# EasyEDA Pro project 立创EDAPRO__v1.1.0.eprj

# Board A4标准轴
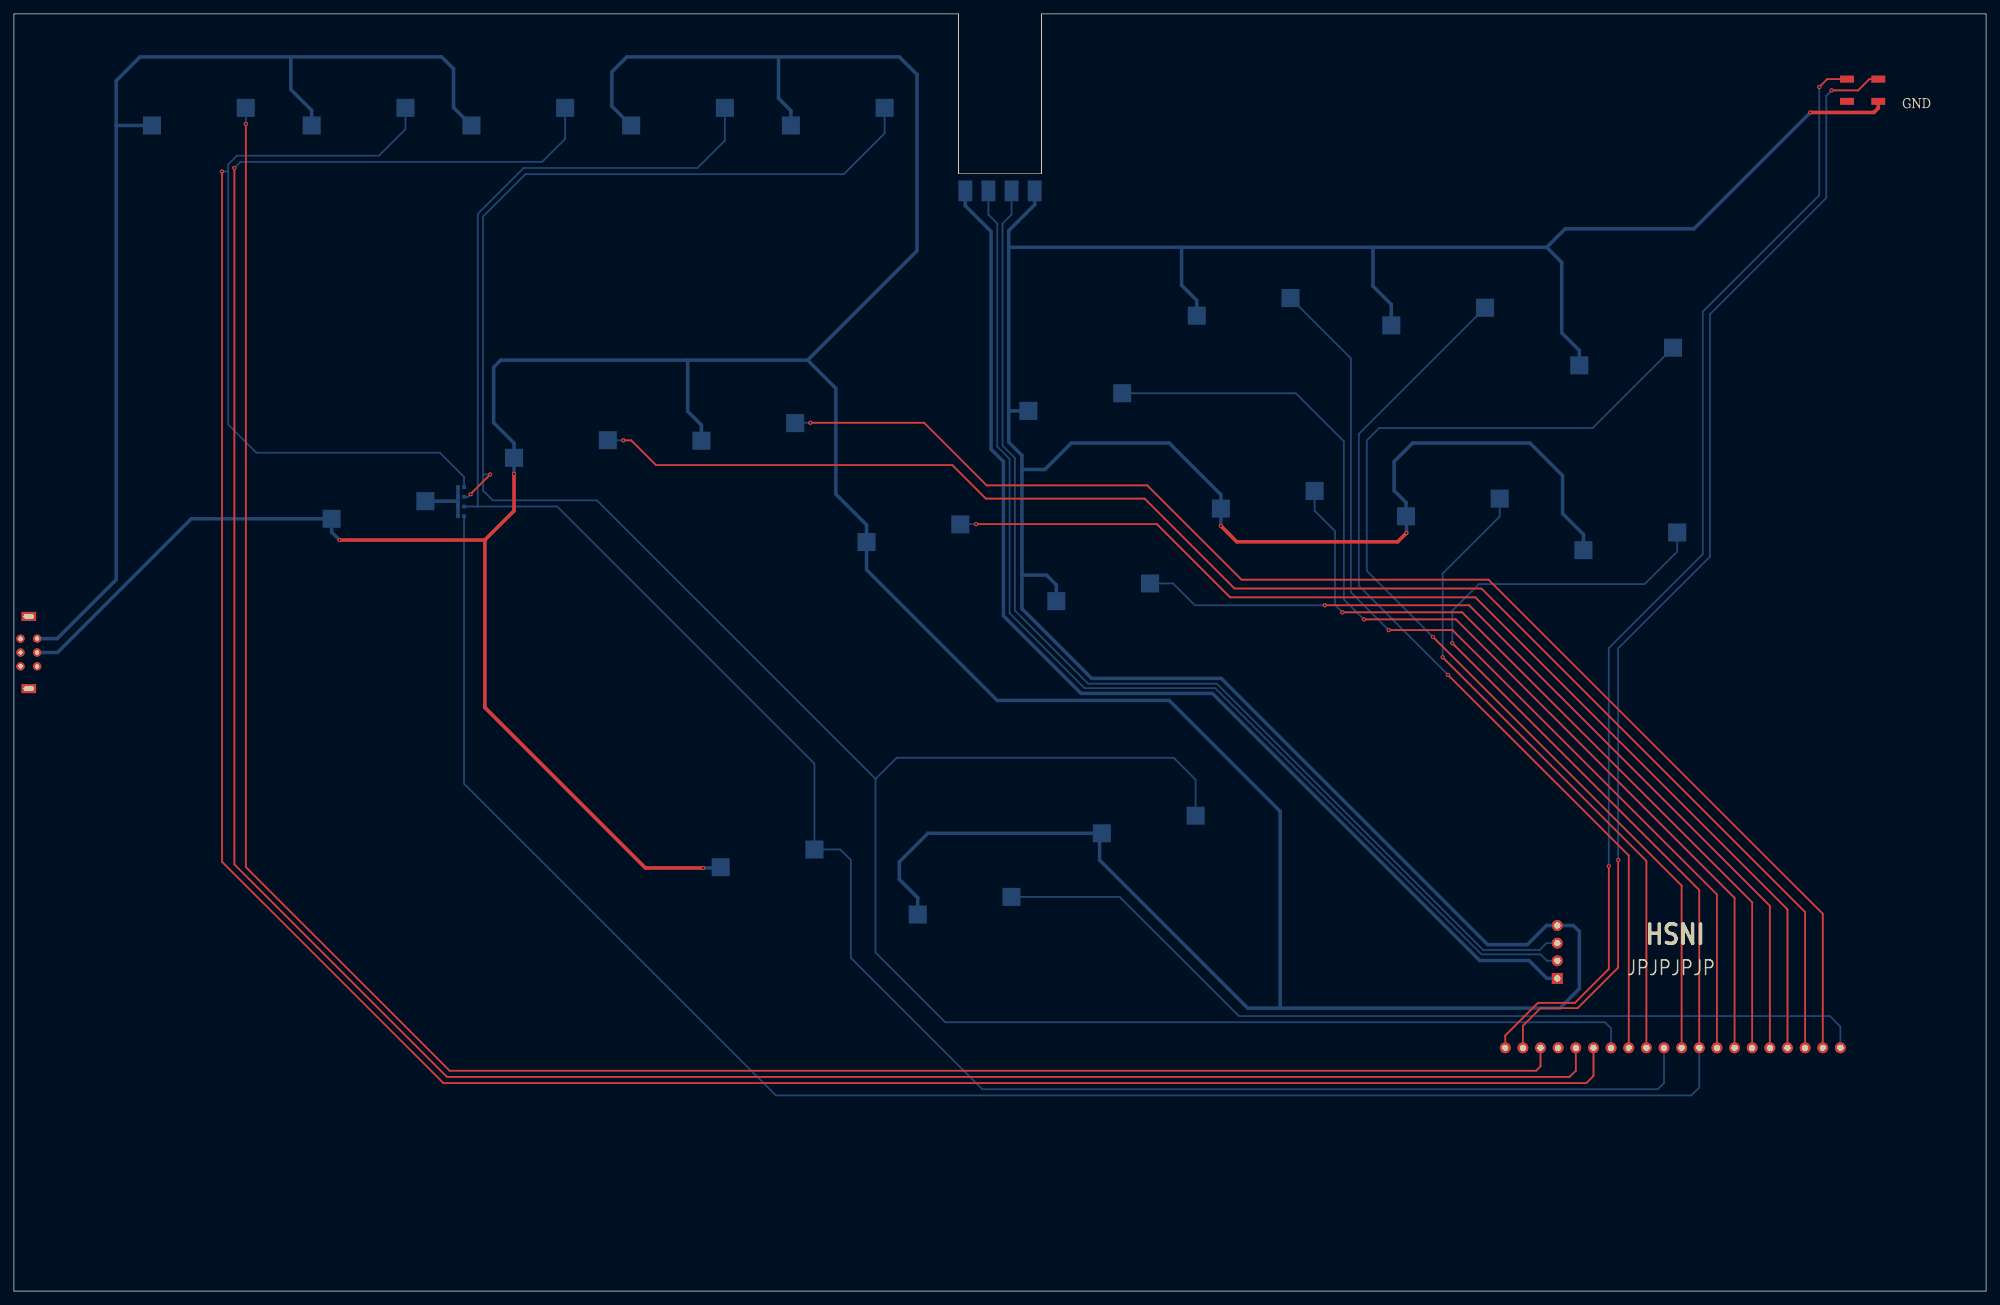
[diagram p0: board, top side]
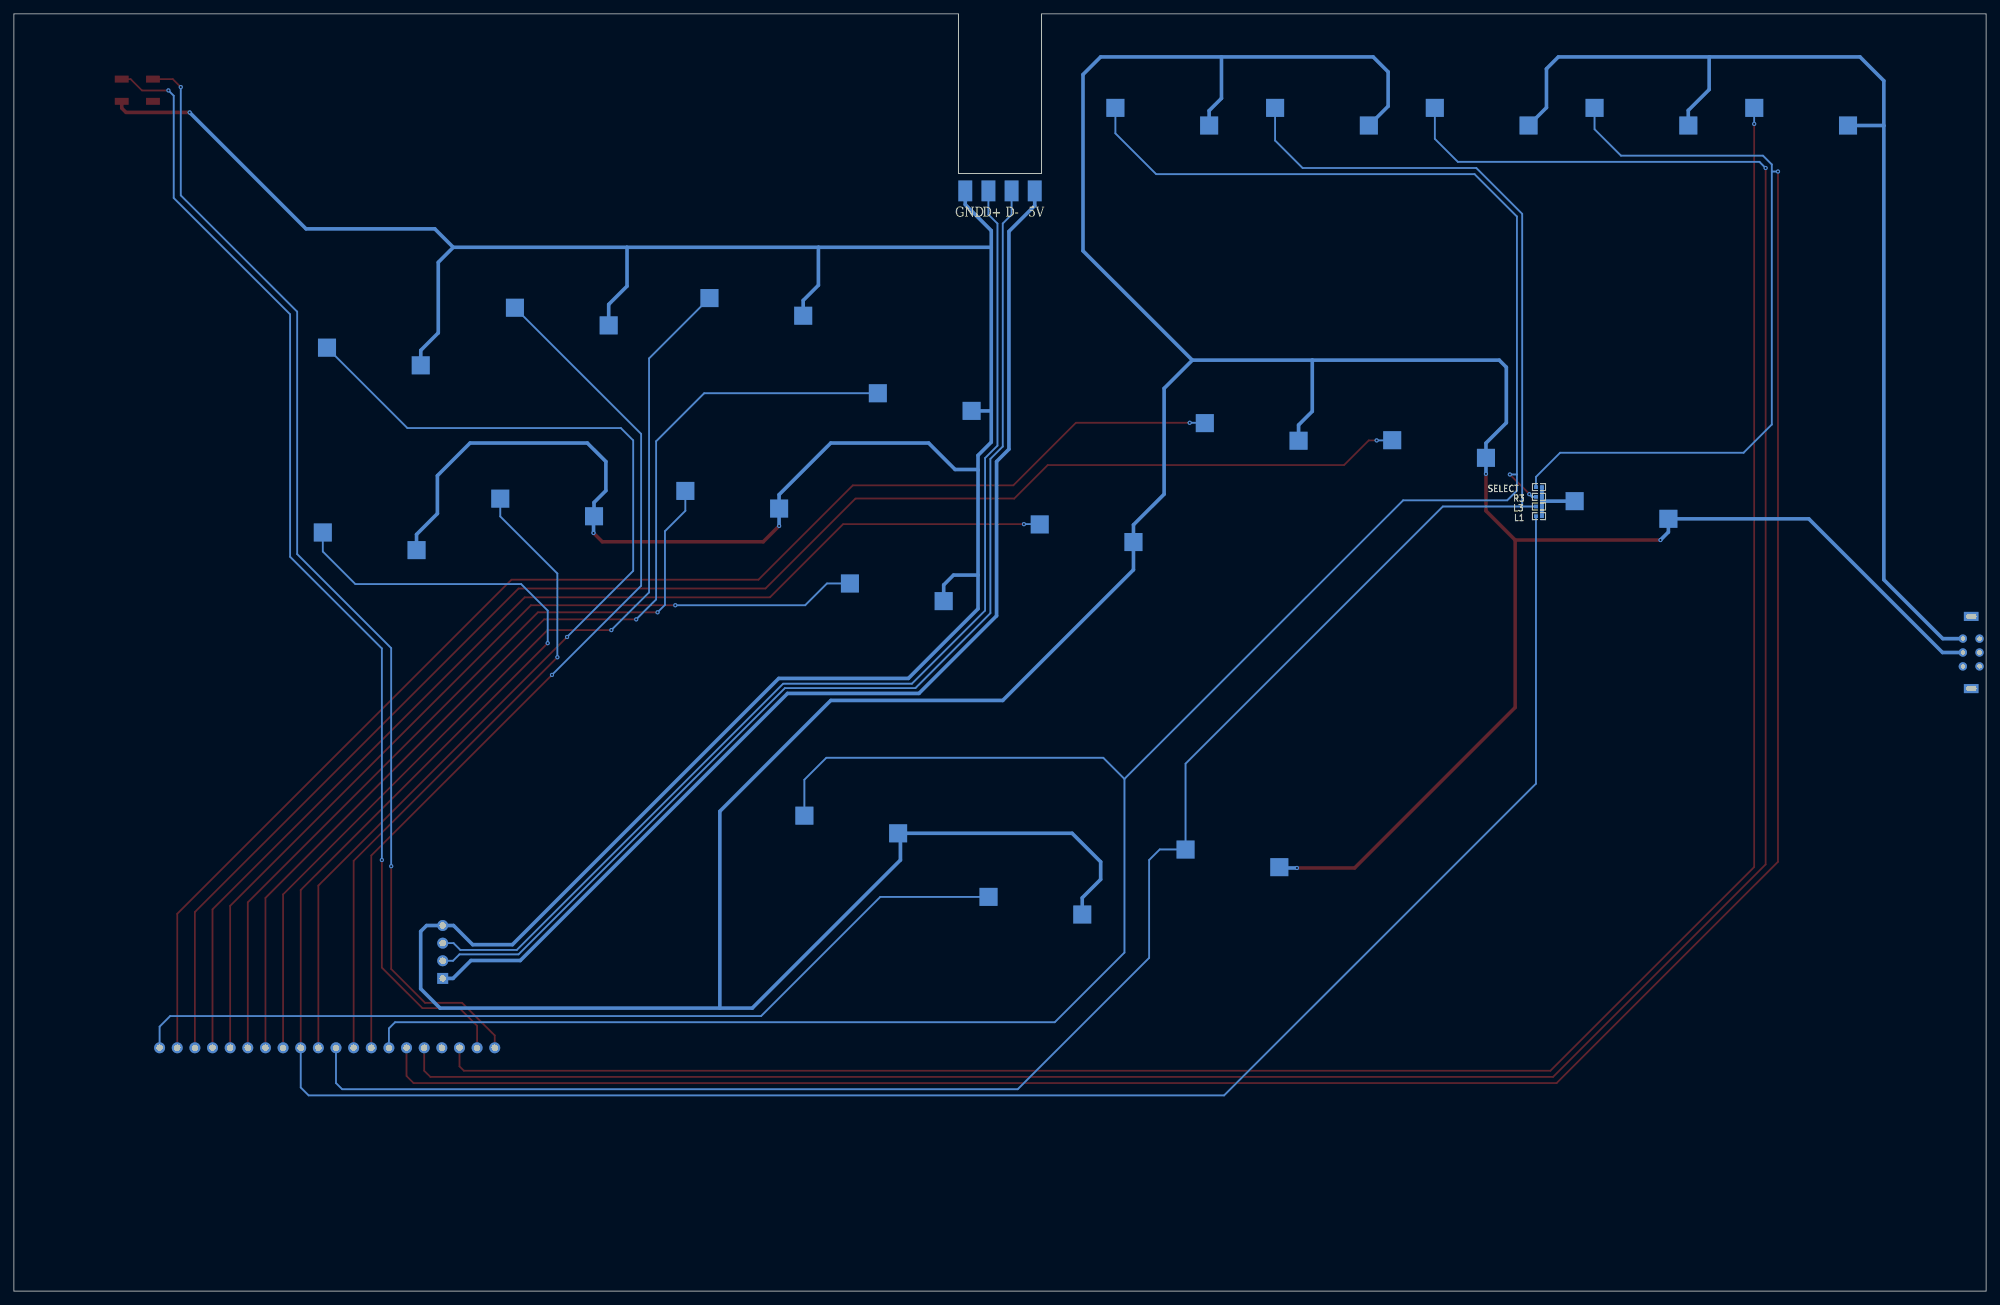
[diagram p1: board, bottom side, seen from below]

Outline 284 x 184 mm; copper layers: Top Layer, Bottom Layer. Coordinates in mm from the lower left corner of the outline.
Outline path: 0,184 136,184 136,161 148,161 148,184 284,184 284,0 0,0 0,184
Stack: Top Layer 0.035mm / Dielectric1 1.51mm FR4 er 4.5 / Bottom Layer 0.035mm

## Design rules (mm)
template: 自定义配置
spacing copperThickness1oz (default): track to track 0.102, other pairs 0.152 to 0.3
spacing copperThickness2oz: track to track 0.203, other pairs 0.152 to 0.3
track width copperThickness1oz (default): min 0.127, default 0.254, max 2.54
track width copperThickness2oz: min 0.203, default 0.254, max 2.54
track width 20mil: min 0.508, default 0.508, max 0.508
differential pair differentialPair (default): width min 0.127, default 0.254, max 2.54; gap min 0.152, default 0.152
via viaSize (default): diameter min 0.5, default 0.61, max 10; hole min 0.3, default 0.305, max 6.3
net GND uses 20mil
net GND1 uses 20mil

## Placement (name value [footprint] x y rotation side)
L1  10K  [R0402]  64.39 111.63 180 bottom
L3  10K  [R0402]  64.39 113.03 180 bottom
NOREF  -  [Pad_e667]  99.01 122.51 0 top
NOREF#2  -  [Pad_e668]  112.51 125.05 0 top
NOREF#3  -  [Pad_e623]  56.39 170.46 0 top
NOREF#4  -  [Pad_e499]  257.94 35.05 0 top
NOREF#5  -  [Pad_e374]  0.95 90 270 top
NOREF#6  -  [Pad_e644]  125.38 170.46 0 top
NOREF#7  -  [Pad_ie763]  268.47 174.6 0 top
NOREF#8  -  [Pad_e402]  247.78 35.05 0 top
NOREF#9  -  [Pad_e382]  3.35 92 270 top
NOREF#10  -  [Pad_e386]  217.3 35.05 0 top
NOREF#11  -  [Pad_e388]  222.25 50.13 270 top
NOREF#12  -  [Pad_e534]  143.67 158.5 180 top
NOREF#13  -  [Pad_e387]  219.84 35.05 0 top
NOREF#14  -  [Pad_ie761]  268.47 171.4 0 top
NOREF#15  -  [Pad_e531]  147 158.5 180 top
NOREF#16  -  [Pad_e556]  137 158.5 180 top
NOREF#17  -  [Pad_e375]  0.95 94 270 top
NOREF#18  -  [Pad_e730]  150.11 99.4 0 top
NOREF#19  -  [Pad_e695]  225.41 133.37 0 top
NOREF#20  -  [Pad_e384]  3.35 94 270 top
NOREF#21  -  [Pad_e393]  224.92 35.05 0 top
NOREF#22  -  [Pad_e660]  72.02 120.04 0 top
NOREF#23  -  [Pad_e385]  214.76 35.05 0 top
NOREF#24  -  [Pad_e611]  33.38 170.46 0 top
NOREF#25  -  [Pad_e681]  146.09 126.81 0 top
NOREF#26  -  [Pad_ie760]  263.97 171.4 0 top
NOREF#27  -  [Pad_e682]  159.59 129.35 0 top
NOREF#28  -  [Pad_e674]  122.78 107.91 0 top
NOREF#29  -  [Pad_e737]  101.78 61.07 0 top
NOREF#30  -  [Pad_e622]  42.88 167.92 0 top
NOREF#31  -  [Pad_e395]  230 35.05 0 top
NOREF#32  -  [Pad_e643]  111.89 167.92 0 top
NOREF#33  -  [Pad_e390]  222.25 47.59 270 top
NOREF#34  -  [Pad_e401]  245.24 35.05 0 top
NOREF#35  -  [Pad_e377]  2.15 86.8 0 top
NOREF#36  -  [Pad_e738]  115.28 63.61 0 top
NOREF#37  -  [Pad_e405]  255.4 35.05 0 top
NOREF#38  -  [Pad_e709]  200.46 111.63 0 top
NOREF#39  -  [Pad_e689]  183.84 143.06 0 top
NOREF#40  -  [Pad_e500]  260.48 35.05 0 top
NOREF#41  -  [Pad_e399]  240.16 35.05 0 top
NOREF#42  -  [Pad_e541]  140.33 158.5 180 top
NOREF#43  -  [Pad_e724]  187.31 115.28 0 top
NOREF#44  -  [Pad_e404]  252.86 35.05 0 top
NOREF#45  -  [Pad_e607]  19.89 167.92 0 top
NOREF#46  -  [Pad_e389]  222.25 52.67 270 top
NOREF#47  -  [Pad_e629]  65.89 167.92 0 top
NOREF#48  -  [Pad_e744]  130.15 54.25 0 top
NOREF#49  -  [Pad_e661]  85.52 122.58 0 top
NOREF#50  -  [Pad_e731]  163.61 101.94 0 top
NOREF#51  -  [Pad_e505]  263.02 35.05 0 top
NOREF#52  -  [Pad_e636]  88.89 167.92 0 top
NOREF#53  -  [Pad_e397]  235.08 35.05 0 top
NOREF#54  -  [Pad_e751]  156.67 65.95 0 top
NOREF#55  -  [Pad_e376]  0.95 92 270 top
NOREF#56  -  [Pad_e403]  250.32 35.05 0 top
NOREF#57  -  [Pad_e710]  213.96 114.17 0 top
NOREF#58  -  [Pad_e383]  3.35 90 270 top
NOREF#59  -  [Pad_e381]  2.15 97.2 0 top
NOREF#60  -  [Pad_e391]  222.25 45.05 270 top
NOREF#61  -  [Pad_e752]  170.17 68.49 0 top
NOREF#62  -  [Pad_e745]  143.65 56.79 0 top
NOREF#63  -  [Pad_e398]  237.62 35.05 0 top
NOREF#64  -  [Pad_e696]  238.91 135.91 0 top
NOREF#65  -  [Pad_e630]  79.39 170.46 0 top
NOREF#66  -  [Pad_e723]  173.81 112.74 0 top
NOREF#67  -  [Pad_ie762]  263.97 174.6 0 top
NOREF#68  -  [Pad_e688]  170.34 140.52 0 top
NOREF#69  -  [Pad_e702]  198.35 139.13 0 top
NOREF#70  -  [Pad_e392]  222.38 35.05 0 top
NOREF#71  -  [Pad_e716]  226.02 106.75 0 top
NOREF#72  -  [Pad_e400]  242.7 35.05 0 top
NOREF#73  -  [Pad_e637]  102.39 170.46 0 top
NOREF#74  -  [Pad_e703]  211.85 141.67 0 top
NOREF#75  -  [Pad_e1111]  59.25 113.8 0 top
NOREF#76  -  [Pad_e717]  239.52 109.29 0 top
NOREF#77  -  [Pad_e675]  136.28 110.45 0 top
NOREF#78  -  [Pad_e650]  45.75 111.26 0 top
NOREF#79  -  [Pad_e394]  227.46 35.05 0 top
NOREF#80  -  [Pad_e396]  232.54 35.05 0 top
R3  10K  [R0402]  64.39 114.43 180 bottom
SELECT  10K  [R0402]  64.39 115.82 180 bottom

## Footprints (pads in the part's own frame, mm; a bottom-side part is the same pattern mirrored in y, then rotated)
Pad_e374
  round 1.2 hole 0.6: (0,0)
Pad_e375
  round 1.2 hole 0.6: (0,0)
Pad_e376
  round 1.2 hole 0.6: (0,0)
Pad_e377
  rect 2.1x1.3 hole 1.5x0.7: (0,0)
Pad_e381
  rect 2.1x1.3 hole 1.5x0.7: (0,0)
Pad_e382
  round 1.2 hole 0.6: (0,0)
Pad_e383
  round 1.2 hole 0.6: (0,0)
Pad_e384
  round 1.2 hole 0.6: (0,0)
Pad_e385
  round 1.575 hole 0.889: (0,0)
Pad_e386
  round 1.575 hole 0.889: (0,0)
Pad_e387
  round 1.575 hole 0.889: (0,0)
Pad_e388
  round 1.575 hole 0.889: (0,0)
Pad_e389
  round 1.575 hole 0.889: (0,0)
Pad_e390
  round 1.575 hole 0.889: (0,0)
Pad_e391
  rect 1.575x1.575 hole 0.889: (0,0)
Pad_e392
  round 1.575 hole 0.889: (0,0)
Pad_e393
  round 1.575 hole 0.889: (0,0)
Pad_e394
  round 1.575 hole 0.889: (0,0)
Pad_e395
  round 1.575 hole 0.889: (0,0)
Pad_e396
  round 1.575 hole 0.889: (0,0)
Pad_e397
  round 1.575 hole 0.889: (0,0)
Pad_e398
  round 1.575 hole 0.889: (0,0)
Pad_e399
  round 1.575 hole 0.889: (0,0)
Pad_e400
  round 1.575 hole 0.889: (0,0)
Pad_e401
  round 1.575 hole 0.889: (0,0)
Pad_e402
  round 1.575 hole 0.889: (0,0)
Pad_e403
  round 1.575 hole 0.889: (0,0)
Pad_e404
  round 1.575 hole 0.889: (0,0)
Pad_e405
  round 1.575 hole 0.889: (0,0)
Pad_e499
  round 1.575 hole 0.889: (0,0)
Pad_e500
  round 1.575 hole 0.889: (0,0)
Pad_e505
  round 1.575 hole 0.889: (0,0)
Pad_e531
  rect 2x3 smd far side: (0,0)
Pad_e534
  rect 2x3 smd far side: (0,0)
Pad_e541
  rect 2x3 smd far side: (0,0)
Pad_e556
  rect 2x3 smd far side: (0,0)
Pad_e607
  rect 2.6x2.6 smd far side: (0,0)
Pad_e611
  rect 2.6x2.6 smd far side: (0,0)
Pad_e622
  rect 2.6x2.6 smd far side: (0,0)
Pad_e623
  rect 2.6x2.6 smd far side: (0,0)
Pad_e629
  rect 2.6x2.6 smd far side: (0,0)
Pad_e630
  rect 2.6x2.6 smd far side: (0,0)
Pad_e636
  rect 2.6x2.6 smd far side: (0,0)
Pad_e637
  rect 2.6x2.6 smd far side: (0,0)
Pad_e643
  rect 2.6x2.6 smd far side: (0,0)
Pad_e644
  rect 2.6x2.6 smd far side: (0,0)
Pad_e650
  rect 2.6x2.6 smd far side: (0,0)
Pad_e660
  rect 2.6x2.6 smd far side: (0,0)
Pad_e661
  rect 2.6x2.6 smd far side: (0,0)
Pad_e667
  rect 2.6x2.6 smd far side: (0,0)
Pad_e668
  rect 2.6x2.6 smd far side: (0,0)
Pad_e674
  rect 2.6x2.6 smd far side: (0,0)
Pad_e675
  rect 2.6x2.6 smd far side: (0,0)
Pad_e681
  rect 2.6x2.6 smd far side: (0,0)
Pad_e682
  rect 2.6x2.6 smd far side: (0,0)
Pad_e688
  rect 2.6x2.6 smd far side: (0,0)
Pad_e689
  rect 2.6x2.6 smd far side: (0,0)
Pad_e695
  rect 2.6x2.6 smd far side: (0,0)
Pad_e696
  rect 2.6x2.6 smd far side: (0,0)
Pad_e702
  rect 2.6x2.6 smd far side: (0,0)
Pad_e703
  rect 2.6x2.6 smd far side: (0,0)
Pad_e709
  rect 2.6x2.6 smd far side: (0,0)
Pad_e710
  rect 2.6x2.6 smd far side: (0,0)
Pad_e716
  rect 2.6x2.6 smd far side: (0,0)
Pad_e717
  rect 2.6x2.6 smd far side: (0,0)
Pad_e723
  rect 2.6x2.6 smd far side: (0,0)
Pad_e724
  rect 2.6x2.6 smd far side: (0,0)
Pad_e730
  rect 2.6x2.6 smd far side: (0,0)
Pad_e731
  rect 2.6x2.6 smd far side: (0,0)
Pad_e737
  rect 2.6x2.6 smd far side: (0,0)
Pad_e738
  rect 2.6x2.6 smd far side: (0,0)
Pad_e744
  rect 2.6x2.6 smd far side: (0,0)
Pad_e745
  rect 2.6x2.6 smd far side: (0,0)
Pad_e751
  rect 2.6x2.6 smd far side: (0,0)
Pad_e752
  rect 2.6x2.6 smd far side: (0,0)
Pad_e1111
  rect 2.6x2.6 smd far side: (0,0)
Pad_ie760
  rect 2x1 smd: (0,0)
Pad_ie761
  rect 2x1 smd: (0,0)
Pad_ie762
  rect 2x1 smd: (0,0)
Pad_ie763
  rect 2x1 smd: (0,0)
R0402
  rect 0.566x0.54 smd: 1(-0.433,0) 2(0.433,0)

## Nets
GND: NOREF. NOREF#9. NOREF#14. NOREF#15. NOREF#18. NOREF#19. NOREF#22. NOREF#25. NOREF#28. NOREF#29. NOREF#32. NOREF#38. NOREF#46. NOREF#48. NOREF#52. NOREF#54. NOREF#66. NOREF#68. NOREF#69. NOREF#71. NOREF#78.
GND1: NOREF#20. NOREF#30. NOREF#45. NOREF#47.
VCC: NOREF#23. NOREF#67.
+: NOREF#16. NOREF#60.
A: NOREF#44. NOREF#50.
ADD: L1.2 L3.2 NOREF#75. R3.2 SELECT.2
B: NOREF#43. NOREF#56.
D+: NOREF#11. NOREF#12.
D-: NOREF#33. NOREF#42.
DIN: NOREF#7. NOREF#10.
DOWN: NOREF#2. NOREF#40.
HOME: NOREF#13. NOREF#24.
L1: L1.1 NOREF#72. NOREF#76.
L2: NOREF#41. NOREF#64.
L3: L3.1 NOREF#36. NOREF#63. NOREF#73.
LEFT: NOREF#4. NOREF#49.
R1: NOREF#53. NOREF#57.
R2: NOREF#74. NOREF#80.
R3: NOREF#6. NOREF#31. NOREF#61. R3.1
RIGHT: NOREF#37. NOREF#77.
SELECT: NOREF#3. NOREF#79. SELECT.1
START: NOREF#21. NOREF#65.
UP: NOREF#51. NOREF#62.
X: NOREF#8. NOREF#27.
Y: NOREF#34. NOREF#39.

## Via types
v1: diameter 0.61, hole 0.305, Top Layer to Bottom Layer, 26 vias

## Routing (per net, layer and track width the routed paths; a pad name or vN(x,y) marks a point on that pad's centre or on a via; arc(x,y) is an arc through that point)
GND: length 1076.1
  Top Layer w0.508: v1(72.02,117.73) 72.02,112.41 67.82,108.2 ; 268.47,171.4 268.47,170.43 267.84,169.8 v1(258.69,169.8) ; 67.82,108.2 v1(46.9,108.2) ; 67.82,108.2 67.82,84.07 90.93,60.96 v1(99.24,60.96) ; v1(173.81,110.24) 176.09,107.95 199.26,107.95 v1(200.53,109.22)
  Bottom Layer w0.508: v1(200.53,109.22) 200.53,111.55 200.46,111.63 200.46,113.61 198.75,115.32 198.75,119.51 201.42,122.17 218.31,122.17 223.01,117.47 223.01,112.01 226.02,109.01 226.02,106.75 ; 99.01,122.51 99.01,124.77 97.03,126.75 97.03,134.11 97.03,134.11 ; 130.15,54.25 130.15,56.66 127.51,59.31 127.51,61.85 131.61,65.95 156.67,65.95 ; 143.26,126.82 143.26,122.3 145.16,120.4 145.16,118.29 ; 143.26,126.82 143.26,150.38 ; 143.26,126.82 143.27,126.81 146.09,126.81 ; 182.35,40.77 222.63,40.77 225.43,43.56 225.43,51.82 224.57,52.67 220.69,52.67 217.93,49.91 212.22,49.91 173.86,88.27 155.19,88.27 145.16,98.3 145.16,103.15 ; 182.35,40.77 182.35,69.11 166.37,85.09 141.6,85.09 122.78,103.91 122.78,110.39 118.36,114.81 118.36,130.05 114.3,134.11 ; 182.35,40.77 177.67,40.77 156.34,62.1 156.34,65.79 ; 114.3,134.11 97.03,134.11 ; 114.3,134.11 130.05,149.86 130.05,175.26 127.51,177.8 110.11,177.8 ; 143.26,150.38 143.26,152.78 147,156.53 147,158.5 ; 143.26,150.38 143.27,150.37 168.13,150.37 ; 3.35,92 6.27,92 25.54,111.26 45.75,111.26 45.75,109.35 v1(46.9,108.2) ; 145.16,118.29 145.16,103.15 ; 145.16,118.29 145.23,118.36 148.46,118.36 152.27,122.17 166.37,122.17 173.81,114.74 v1(173.81,110.24) ; 145.16,103.15 148.69,103.15 150.11,101.73 150.11,99.4 ; v1(72.02,117.73) 72.02,122.16 69.09,125.1 69.09,133.09 70.1,134.11 97.03,134.11 ; 195.74,150.37 168.13,150.37 ; 195.74,150.37 195.71,150.33 195.71,144.78 198.35,142.14 198.35,139.13 ; 195.74,150.37 220.73,150.37 ; 168.13,150.37 168.15,150.35 168.15,144.91 170.34,142.72 170.34,140.52 ; v1(258.69,169.8) 241.93,153.03 223.39,153.03 220.73,150.37 ; 110.11,177.8 110.11,171.83 111.89,170.06 111.89,167.92 ; 110.11,177.8 88.27,177.8 86.11,175.64 86.11,170.7 88.89,167.92 ; 220.73,150.37 222.88,148.21 222.88,138.05 225.41,135.52 225.41,133.37 ; v1(99.24,60.96) 101.67,60.96 101.78,61.07
GND1: length 163
  Bottom Layer w0.508: 3.35,94 6.24,94 14.73,102.49 14.73,167.89 ; 19.89,167.92 14.76,167.92 14.73,167.89 ; 42.88,167.92 42.88,170.09 39.88,173.1 39.88,177.75 39.83,177.8 ; 39.83,177.8 18.16,177.8 14.73,174.37 14.73,167.89 ; 39.83,177.8 61.59,177.8 63.31,176.09 63.31,170.5 65.89,167.92
VCC: length 164.7
  Top Layer w0.254: 214.76,35.05 214.76,36.83 219.46,41.53 224.79,41.53 229.67,46.41 v1(229.67,61.21) ; v1(259.97,173.46) 261.11,174.6 263.97,174.6
  Bottom Layer w0.254: v1(229.67,61.21) 229.67,92.64 243.21,106.17 243.21,141.1 259.97,157.86 v1(259.97,173.46)
+: length 164.9
  Bottom Layer w0.508: 222.25,45.05 220.76,45.05 218.19,47.62 211.07,47.62 172.59,86.11 153.67,86.11 142.49,97.28 142.49,119.51 140.72,121.28 140.72,152.65 137,156.37 137,158.5
A: length 128.9
  Top Layer w0.254: 252.86,35.05 252.86,55.5 209.55,98.81 v1(188.76,98.81)
  Bottom Layer w0.254: 163.61,101.94 166.92,101.94 170.05,98.81 v1(188.76,98.81)
ADD: length 8.9
  Bottom Layer w0.508: 63.96,113.75 63.9,113.8 59.25,113.8 ; 63.96,113.75 R3.2 SELECT.2 ; 63.96,113.75 L3.2 L1.2
B: length 116.4
  Top Layer w0.254: v1(191.31,97.79) 208.53,97.79 250.32,56.01 250.32,35.05
  Bottom Layer w0.254: v1(191.31,97.79) 190.25,98.86 190.25,109.47 187.31,112.41 187.31,115.28
D+: length 160.5
  Bottom Layer w0.254: 222.25,50.13 220.69,50.13 219.71,49.15 211.58,49.15 173.23,87.5 154.69,87.5 144.15,98.04 144.15,120.02 142.37,121.79 142.37,153.8 143.67,155.1 143.67,158.5
D-: length 161.7
  Bottom Layer w0.254: 140.33,158.5 140.33,155.07 141.6,153.8 141.6,121.67 143.38,119.89 143.38,97.66 154.18,86.87 172.97,86.87 211.33,48.51 219.84,48.51 220.76,47.59 222.25,47.59
DIN: length 166.9
  Top Layer w0.254: 268.47,174.6 267.18,174.6 265.56,172.97 v1(261.75,172.97) ; v1(231.01,62.1) 231.01,46.61 225.17,40.77 219.84,40.77 217.3,38.23 217.3,35.05
  Bottom Layer w0.254: v1(231.01,62.1) 231.01,92.58 244.22,105.79 244.22,140.72 260.99,157.48 260.99,172.21 v1(261.75,172.97)
DOWN: length 196.6
  Top Layer w0.254: 260.48,35.05 260.48,54.36 212.34,102.49 176.78,102.49 163.19,116.08 140.08,116.08 131.06,125.09 v1(114.68,125.09)
  Bottom Layer w0.254: v1(114.68,125.09) 112.56,125.09 112.51,125.05
HOME: length 310.9
  Top Layer w0.254: 219.84,35.05 219.84,32.38 219.2,31.75 62.74,31.75 33.4,61.09 v1(33.4,168.15)
  Bottom Layer w0.254: v1(33.4,168.15) 33.4,170.44 33.38,170.46
L1: length 357.6
  Top Layer w0.254: v1(207.13,93.34) 242.7,57.78 242.7,35.05
  Bottom Layer w0.254: 239.52,109.29 239.52,106.55 234.82,101.85 210.95,101.85 207.13,98.04 v1(207.13,93.34) ; L1.1 64.82,73.1 109.73,28.19 241.55,28.19 242.7,29.34 242.7,35.05
L2: length 155.9
  Top Layer w0.254: v1(204.34,94.23) 240.16,58.42 240.16,35.05
  Bottom Layer w0.254: v1(204.34,94.23) 194.82,103.76 194.82,122.56 196.6,124.33 227.34,124.33 238.91,135.91
L3: length 315.4
  Bottom Layer w0.254: L3.1 66.8,113.03 ; 66.8,113.03 78.23,113.03 115.28,75.98 115.28,63.61 115.29,63.63 119,63.63 120.52,62.1 120.52,48.01 139.45,29.08 236.73,29.08 237.62,29.97 237.62,35.05 ; 66.8,113.03 66.8,113.04 66.8,155.19 73.41,161.8 98.42,161.8 102.39,165.76 102.39,170.46
LEFT: length 220.1
  Top Layer w0.254: 257.94,35.05 257.94,54.61 211.33,101.22 175.77,101.22 162.81,114.17 139.95,114.17 135.13,119 92.46,119 88.9,122.56 v1(87.76,122.56)
  Bottom Layer w0.254: v1(87.76,122.56) 85.55,122.56 85.52,122.58
R1: length 94.7
  Top Layer w0.254: v1(205.74,91.31) 235.08,61.98 235.08,35.05
  Bottom Layer w0.254: v1(205.74,91.31) 205.74,103.38 213.96,111.6 213.96,114.17
R2: length 130.2
  Top Layer w0.254: 232.54,35.05 232.54,62.75 v1(206.52,88.77)
  Bottom Layer w0.254: 211.85,141.67 193.68,123.49 193.68,101.61 v1(206.52,88.77)
R3: length 377.9
  Top Layer w0.254: v1(65.79,114.81) 65.79,114.85 v1(68.58,117.65)
  Bottom Layer w0.254: 124.08,73.79 127.13,76.83 167,76.83 170.17,73.67 170.17,68.49 ; 124.08,73.79 83.95,113.92 68.96,113.92 67.56,115.32 67.56,117.65 ; 124.08,73.79 124.08,48.77 134.11,38.74 229.11,38.74 230,37.85 230,35.05 ; R3.1 65.41,114.43 v1(65.79,114.81) ; 67.56,117.65 67.56,154.81 73.66,160.91 119.51,160.91 125.38,166.79 125.38,170.46 ; 67.56,117.65 v1(68.58,117.65)
RIGHT: length 162.1
  Top Layer w0.254: v1(138.56,110.49) 164.59,110.49 175.13,99.95 210.44,99.95 255.4,54.99 255.4,35.05
  Bottom Layer w0.254: 136.28,110.45 136.32,110.49 v1(138.56,110.49)
SELECT: length 422.2
  Top Layer w0.254: v1(29.97,161.29) 29.97,61.85 61.85,29.97 226.44,29.97 227.46,30.99 227.46,35.05
  Bottom Layer w0.254: 56.39,170.46 56.39,167.38 52.58,163.58 32.13,163.58 30.86,162.31 30.86,161.32 ; 30.86,161.32 30.86,124.84 34.92,120.78 61.34,120.78 64.82,117.3 SELECT.1 ; 30.86,161.32 30.83,161.29 v1(29.97,161.29)
START: length 363.7
  Top Layer w0.254: 224.92,35.05 224.92,31.75 224.03,30.86 62.36,30.86 31.75,61.47 v1(31.75,161.8)
  Bottom Layer w0.254: v1(31.75,161.8) 32.64,162.69 76.07,162.69 79.39,166 79.39,170.46
UP: length 130.2
  Bottom Layer w0.254: 143.65,56.79 159.23,56.79 176.4,39.62 261.49,39.62 263.02,38.1 263.02,35.05
X: length 153.2
  Top Layer w0.254: v1(194.39,96.77) 207.65,96.77 247.78,56.64 247.78,35.05
  Bottom Layer w0.254: 159.59,129.35 184.6,129.35 191.52,122.43 191.52,99.65 v1(194.39,96.77)
Y: length 138.8
  Top Layer w0.254: 245.24,35.05 245.24,57.15 207.16,95.22 v1(197.97,95.22)
  Bottom Layer w0.254: v1(197.97,95.22) 192.53,100.66 192.53,134.36 183.84,143.06

## Text on the board
Bottom Silkscreen Layer: 5V | D- | D+ | GND
Top Silkscreen Layer: JPJPJPJP | HSNI | GND
